# Altium project Dozimetr v1.0.PrjPcb
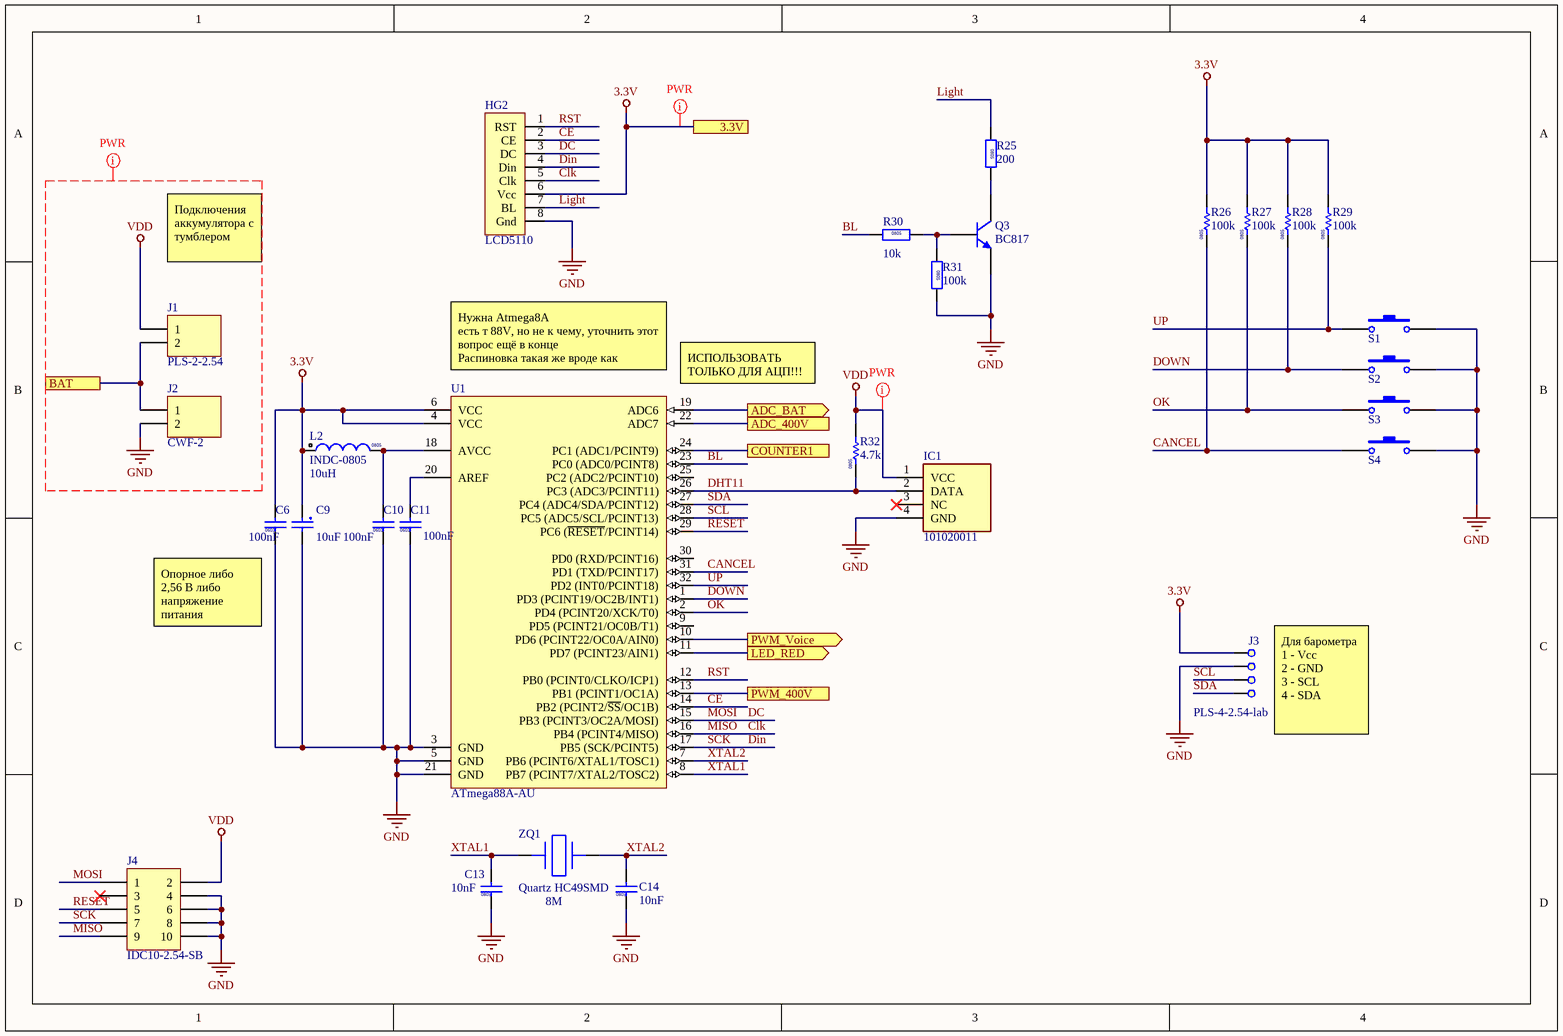
[diagram p0: MCU.SchDoc]
3 sheets, 69 parts. Net scope: flat (ports and power ports of the same name join across sheets).
Board file: PCB_Dozimeter.PcbDoc
Sheets:
  MCU.SchDoc
  High_Voltage.SchDoc
  Indication_and_Notification.SchDoc

## Sheet MCU.SchDoc
size A4

### Parts
C6  value 100nF  [CAPC1608-0603L]  (hidden comment: CAPC_0603)
C9  value 10uF  [TCAPC_A]  (hidden comment: TCAPC_A)
C10  value 100nF  [CAPC1608-0603L]  (hidden comment: CAPC_0603)
C11  value 100nF  [CAPC1608-0603L]  (hidden comment: CAPC_0603)
C13  value 10nF  [CAPC2012-0805M]  (hidden comment: CAPC_0805)
C14  value 10nF  [CAPC2012-0805M]  (hidden comment: CAPC_0805)
HG2  LCD5110  [LCD]
IC1  101020011  [HDRV4W80P0X254_1X4_1200X500X1550P]
J1  PLS-2-2.54  [PLS-2-2.54]
J2  CWF-2  [CWF-2]
J3  PLS-4-2.54-lab  [PLS-4-2.54-lab]
J4  IDC10-2.54-SB  [IDC10-2.54-SB]
L2  INDC-0805  value 10uH  [INDC2012L]
Q3  BC817  [SOT23-3M]
R25  value 200  [RESC2012-0805M]  (hidden comment: RESC_0805_R)
R26  value 100k  [RESC2012-0805M]  (hidden comment: RESC_0805)
R27  value 100k  [RESC2012-0805M]  (hidden comment: RESC_0805)
R28  value 100k  [RESC2012-0805M]  (hidden comment: RESC_0805)
R29  value 100k  [RESC2012-0805M]  (hidden comment: RESC_0805)
R30  value 10k  [RESC2012-0805M]  (hidden comment: RESC_0805_R)
R31  value 100k  [RESC2012-0805M]  (hidden comment: RESC_0805_R)
R32  value 4.7k  [RESC2012-0805M]  (hidden comment: RESC_0805)
S1  Switch  [Switch]  (value not drawn)
S2  Switch  [Switch]  (value not drawn)
S3  Switch  [Switch]  (value not drawn)
S4  Switch  [Switch]  (value not drawn)
U1  ATmega88A-AU  [32A_L]
ZQ1  Quartz HC49SMD  value 8M  [HC-49SMD]

### Ports
3.3V, ADC_400V, ADC_BAT (out), BAT, COUNTER1, LED_RED (out), PWM_400V, PWM_Voice (out)

### Nets
3.3V: C6.2 C9.1 HG2.6(Vcc) J3.1 L2.1 R26.2 R27.2 R28.2 R29.2 U1.4(VCC) U1.6(VCC) ; port 3.3V
GND: C6.1 C9.2 C10.1 C11.1 C13.1 C14.1 HG2.8(Gnd) IC1.4(GND) J2.2 J3.2 J4.4 J4.6 J4.8 J4.10 Q3.2(E) R31.2 S1.2 S2.2 S3.2 S4.2 U1.3(GND) U1.5(GND) U1.21(GND)
VDD: IC1.1(VCC) J1.1 J4.2 R32.2
BL: R30.1 U1.23(PC0_(ADC0/PCINT8))
CANCEL: R26.1 S4.1 U1.31(PD1_(TXD/PCINT17))
CE: HG2.2(CE) U1.14(PB2_(PCINT2/~{SS}/OC1B))
Clk: HG2.5(Clk) J4.9 U1.16(PB4_(PCINT4/MISO))  [also labelled MISO]
DC: HG2.3(DC) J4.1 U1.15(PB3_(PCINT3/OC2A/MOSI))  [also labelled MOSI]
DHT11: IC1.2(DATA) R32.1 U1.26(PC3_(ADC3/PCINT11))
Din: HG2.4(Din) J4.7 U1.17(PB5_(SCK/PCINT5))  [also labelled SCK]
DOWN: R28.1 S2.1 U1.1(PD3_(PCINT19/OC2B/INT1))
Light: HG2.7(BL) R25.1
OK: R27.1 S3.1 U1.2(PD4_(PCINT20/XCK/T0))
RESET: J4.5 U1.29(PC6_(~{RESET}/PCINT14))
RST: HG2.1(RST) U1.12(PB0_(PCINT0/CLKO/ICP1))
SCL: J3.3 U1.28(PC5_(ADC5/SCL/PCINT13))
SDA: J3.4 U1.27(PC4_(ADC4/SDA/PCINT12))
UP: R29.1 S1.1 U1.32(PD2_(INT0/PCINT18))
XTAL1: C13.2 U1.8(PB7_(PCINT7/XTAL2/TOSC2)) ZQ1.1
XTAL2: C14.2 U1.7(PB6_(PCINT6/XTAL1/TOSC1)) ZQ1.2
NetC3_2: U1.22(ADC7) ; port ADC_400V
NetC10_2: C10.2 L2.2 U1.18(AVCC)
NetC11_2: C11.2 U1.20(AREF)
NetJ1_2: J1.2 J2.1 ; port BAT
NetQ3_1: Q3.1(B) R30.2 R31.1
NetQ3_3: Q3.3(C) R25.2
NetR13_1: U1.13(PB1_(PCINT1/OC1A)) ; port PWM_400V
NetR17_1: U1.24(PC1_(ADC1/PCINT9)) ; port COUNTER1
NetR21_1: U1.11(PD7_(PCINT23/AIN1)) ; port LED_RED
NetR22_1: U1.10(PD6_(PCINT22/OC0A/AIN0)) ; port PWM_Voice
NetU1_19: U1.19(ADC6) ; port ADC_BAT

Not connected (* = marked no-connect by the designer): IC1 3(NC)*; J4 3*; U1 9(PD5_(PCINT21/OC0B/T1)) 25(PC2_(ADC2/PCINT10)) 30(PD0_(RXD/PCINT16))

### Layout directives
mark named PWR: 3.3V, GND, VDD

### Notes on the sheet
- Подключения аккумулятора с тумблером
- (near U1) Нужна Atmega8A
  есть т 88V, но не к чему, уточнить этот вопрос ещё в конце
  Распиновка такая же вроде как
- (near U1) ИСПОЛЬЗОВАТЬ ТОЛЬКО ДЛЯ АЦП!!!
- Опорное либо 2,56 В либо напряжение питания
- (near J3) Для барометра
  1 - Vcc
  2 - GND
  3 - SCL
  4 - SDA
- (in symbol CAPC_0603) 0603
- (in symbol CAPC_0805) 0805
- (in symbol INDC-0805) 0805
- (in symbol RESC_0805) 0805
- (in symbol RESC_0805_R) 0805

### Library data of the parts
C6 C10 C11 = CAPC_0603: Capacitor 0603
C9 = TCAPC_A: Capacitor tantalum SMD type A
C13 C14 = CAPC_0805: Capacitor 0805
HG2 = LCD5110: Дисплей Nokia 5110 84x48
IC1 = 101020011: Integrated Circuit; Manufacturer_Name: Seeed Studio; Datasheet Link: https://componentsearchengine.com/Datasheets/1/101020011.pdf; Height: 15.5mm; Manufacturer_Part_Number: 101020011; Mouser Part Number: 713-101020011; Mouser Price/Stock: https://www.mouser.com/Search/Refine.aspx?Keyword=713-101020011; RS Part Number: 1743237; RS Price/Stock: http://uk.rs-online.com/web/p/products/1743237
J4 = IDC10-2.54-SB: IDC10 2.54 mm pitch Straight, plastic Box; LatestRevisionDate: 17-Jul-2002; LatestRevisionNote: Re-released for DXP Platform.; Publisher: Altium Limited
L2 = INDC-0805: Chip Inductor, Body Body 2.0x1.2mm
Q3 = BC817: BC817 NPN Transistor
R25 R30 R31 = RESC_0805_R: Resistor 0805
R26-R29 R32 = RESC_0805: Resistor 0805
U1 = ATmega88A-AU: 8-bit AVR Microcontroller, 8KB Flash, 512 Bytes EEPROM, 1KB SRAM, 32-pin TQFP, Industrial Grade (-40°C to 85°C); Published: 1-Apr-2010; DatasheetVersion: revA, Jan-2010; PackageVersion: revB, Oct-2001; PackageReference: 32A; Publisher: Altium Limited; PackageDescription: 32-Lead, 7x7x1.0 mm Body, 0.8mm Lead Pitch, Thin Profile Plastic Quad Flat Package (TQFP); Supplier 1: Digi-Key; Supplier Part Number 1: ATMEGA88A-AU-ND; Supplier 2: Mouser; Supplier Part Number 2: 556-ATMEGA88A-AU; Code_JEDEC: MS-026-ABA; ComponentLink1Description: Manufacturer Link; ComponentLink1URL: http://www.atmel.com/products/avr/default.asp?; ComponentLink2Description: ATmega48A/48PA/88A/88PA/168A/168PA/328/328P Datasheet; ComponentLink2URL: http://www.atmel.com/dyn/resources/prod_documents/8271.pdf; ComponentLink3Description: ATmega48A/48PA/88A/88PA/168A/168PA/328/328P Summary; ComponentLink3URL: http://www.atmel.com/dyn/resources/prod_documents/8271S.pdf; ComponentLink4Description: Atmel.com Home; ComponentLink4URL: http://www.atmel.com
J1 = PLS-2-2.54: LatestRevisionDate: 17-Jul-2002; LatestRevisionNote: Re-released for DXP Platform.; Publisher: Altium Limited
J3 = PLS-4-2.54-lab: LatestRevisionDate: 17-Jul-2002; LatestRevisionNote: Re-released for DXP Platform.; Publisher: Altium Limited
S1-S4 = Switch: Published: 24-Mar-1999; LatestRevisionDate: 17-Jul-2002; LatestRevisionNote: Re-released for DXP Platform.; PackageReference: SPST-2; Publisher: Altium Limited

## Sheet High_Voltage.SchDoc
size A4
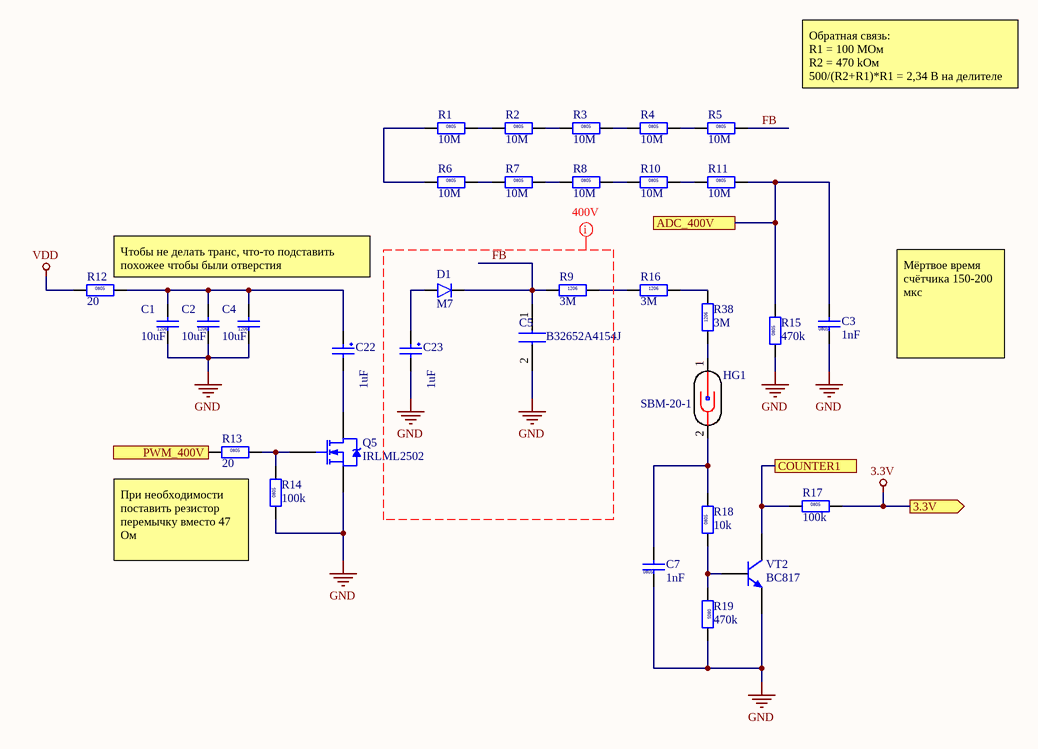
[diagram p1: High_Voltage.SchDoc]

### Parts
C1  value 10uF  [CAPC3216-1206L]  (hidden comment: CAPC_1206)
C2  value 10uF  [CAPC3216-1206L]  (hidden comment: CAPC_1206)
C3  value 1nF  [CAPC2012-0805M]  (hidden comment: CAPC_0805)
C4  value 10uF  [CAPC3216-1206L]  (hidden comment: CAPC_1206)
C5  B32652A4154J  [B32652A4154J]
C7  value 1nF  [CAPC2012-0805M]  (hidden comment: CAPC_0805)
C22  value 1uF  [ECAP811.5]  (hidden comment: ECAP-811.5)
C23  value 1uF  [ECAP16315]  (hidden comment: ECAP-1625)
D1  M7  [DIOM5026X262N]
HG1  SBM-20-1  [SBM-20-1]
Q5  IRLML2502  [SOT23-3L]
R1  value 10M  [RESC2012-0805M]  (hidden comment: RESC_0805_R)
R2  value 10M  [RESC2012-0805M]  (hidden comment: RESC_0805_R)
R3  value 10M  [RESC2012-0805M]  (hidden comment: RESC_0805_R)
R4  value 10M  [RESC2012-0805M]  (hidden comment: RESC_0805_R)
R5  value 10M  [RESC2012-0805M]  (hidden comment: RESC_0805_R)
R6  value 10M  [RESC2012-0805M]  (hidden comment: RESC_0805_R)
R7  value 10M  [RESC2012-0805M]  (hidden comment: RESC_0805_R)
R8  value 10M  [RESC2012-0805M]  (hidden comment: RESC_0805_R)
R9  value 3M  [RESC3216-1206M]  (hidden comment: RESC_1206_R)
R10  value 10M  [RESC2012-0805M]  (hidden comment: RESC_0805_R)
R11  value 10M  [RESC2012-0805M]  (hidden comment: RESC_0805_R)
R12  value 20  [RESC2012-0805M]  (hidden comment: RESC_0805_R)
R13  value 20  [RESC2012-0805M]  (hidden comment: RESC_0805_R)
R14  value 100k  [RESC2012-0805M]  (hidden comment: RESC_0805_R)
R15  value 470k  [RESC2012-0805M]  (hidden comment: RESC_0805_R)
R16  value 3M  [RESC3216-1206M]  (hidden comment: RESC_1206_R)
R17  value 100k  [RESC2012-0805M]  (hidden comment: RESC_0805_R)
R18  value 10k  [RESC2012-0805M]  (hidden comment: RESC_0805_R)
R19  value 470k  [RESC2012-0805M]  (hidden comment: RESC_0805_R)
R38  value 3M  [RESC3216-1206M]  (hidden comment: RESC_1206_R)
VT2  BC817  [SOT23-3M]

### Ports
3.3V (out), ADC_400V, COUNTER1, PWM_400V

### Nets
3.3V: R17.2 ; port 3.3V
GND: C1.1 C2.1 C3.1 C4.1 C5.2 C7.1 C23.2 Q5.2(S) R14.1 R15.1 R19.2 VT2.2(E)
VDD: R12.1
FB: C5.1 D1.1(K) R5.2 R9.1
NetC1_2: C1.2 C2.2 C4.2 C22.1 R12.2
NetC3_2: C3.2 R11.2 R15.2 ; port ADC_400V
NetC7_2: C7.2 HG1.2(K) R18.2
NetC22_2: C22.2 Q5.3(D)
NetC23_1: C23.1 D1.2(A)
NetHG1_1: HG1.1(A) R38.1
NetQ5_1: Q5.1(G) R13.2 R14.2
NetR1_1: R1.1 R6.1
NetR1_2: R1.2 R2.1
NetR2_2: R2.2 R3.1
NetR3_2: R3.2 R4.1
NetR4_2: R4.2 R5.1
NetR6_2: R6.2 R7.1
NetR7_2: R7.2 R8.1
NetR8_2: R8.2 R10.1
NetR9_2: R9.2 R16.1
NetR10_2: R10.2 R11.1
NetR13_1: R13.1 ; port PWM_400V
NetR16_2: R16.2 R38.2
NetR17_1: R17.1 VT2.3(C) ; port COUNTER1
NetR18_1: R18.1 R19.1 VT2.1(B)

### Layout directives
net class 400V: FB, GND

### Notes on the sheet
- Обратная связь:
  R1 = 100 МОм
  R2 = 470 kОм
  500/(R2+R1)*R1 = 2,34 В на делителе
- (near R12) Чтобы не делать транс, что-то подставить похожее чтобы были отверстия
- Мёртвое время счётчика 150-200 мкс
- При необходимости поставить резистор перемычку вместо 47 Ом
- (in symbol CAPC_0805) 0805
- (in symbol CAPC_1206) 1206
- (in symbol RESC_0805_R) 0805
- (in symbol RESC_1206_R) 1206

### Library data of the parts
C1 C2 C4 = CAPC_1206: Capacitor 1206
C3 C7 = CAPC_0805: Capacitor 0805
C5 = B32652A4154J: Capacitor; Manufacturer_Name: EPCOS; Datasheet Link: https://componentsearchengine.com/Datasheets/1/B32652A4154J.pdf; Height: 18mm; Manufacturer_Part_Number: B32652A4154J; Mouser Part Number: 871-B32652A4154J; Mouser Price/Stock: https://www.mouser.com/Search/Refine.aspx?Keyword=871-B32652A4154J
C22 = ECAP-811.5: Capacitor electrolytic 3.5 mm pitch, 8*11.5 body
C23 = ECAP-1625: Capacitor electrolytic 7.5 mm pitch, 16*25 body
D1 = M7: Diode; Manufacturer_Name: MULTICOMP; Manufacturer_Part_Number: SS34A; Datasheet Link: https://componentsearchengine.com/Datasheets/2/SS34A.pdf; Height: 2.62mm
Q5 = IRLML2502: IRLML2502 Hexfet power MOSFET
R1-R8 R10-R15 R17-R19 = RESC_0805_R: Resistor 0805
R9 R16 R38 = RESC_1206_R: Resistor 1206
VT2 = BC817: BC817 NPN Transistor

## Sheet Indication_and_Notification.SchDoc
size A4
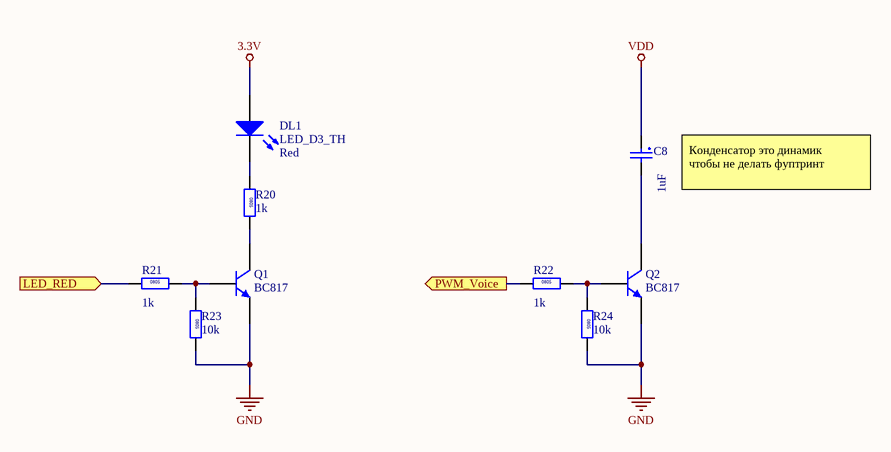
[diagram p2: Indication_and_Notification.SchDoc]

### Parts
C8  value 1uF  [ECAP1325]  (hidden comment: ECAP-1325)
DL1  LED_D3_TH  value Red  [LED_D3_TH]
Q1  BC817  [SOT23-3M]
Q2  BC817  [SOT23-3M]
R20  value 1k  [RESC2012-0805M]  (hidden comment: RESC_0805_R)
R21  value 1k  [RESC2012-0805M]  (hidden comment: RESC_0805_R)
R22  value 1k  [RESC2012-0805M]  (hidden comment: RESC_0805_R)
R23  value 10k  [RESC2012-0805M]  (hidden comment: RESC_0805_R)
R24  value 10k  [RESC2012-0805M]  (hidden comment: RESC_0805_R)

### Ports
LED_RED (in), PWM_Voice (out)

### Nets
3.3V: DL1.1(A)
GND: Q1.2(E) Q2.2(E) R23.2 R24.2
VDD: C8.1
NetC8_2: C8.2 Q2.3(C)
NetDL1_2: DL1.2(K) R20.1
NetQ1_1: Q1.1(B) R21.2 R23.1
NetQ1_3: Q1.3(C) R20.2
NetQ2_1: Q2.1(B) R22.2 R24.1
NetR21_1: R21.1 ; port LED_RED
NetR22_1: R22.1 ; port PWM_Voice

### Notes on the sheet
- (near C8) Конденсатор это динамик
  чтобы не делать фуптринт
- (in symbol RESC_0805_R) 0805

### Library data of the parts
C8 = ECAP-1325: Capacitor electrolytic 5 mm pitch, 13*25 body
DL1 = LED_D3_TH: LED Through hole D3mm
Q1 Q2 = BC817: BC817 NPN Transistor
R20-R24 = RESC_0805_R: Resistor 0805

## Nets that join several sheets
3.3V: MCU (11 pins), High_Voltage (R17.2), Indication_and_Notification (DL1.1)
GND: MCU (23 pins), High_Voltage (12 pins), Indication_and_Notification (Q1.2 Q2.2 R23.2 R24.2)
VDD: MCU (IC1.1 J1.1 J4.2 R32.2), High_Voltage (R12.1), Indication_and_Notification (C8.1)
NetC3_2: MCU (U1.22), High_Voltage (C3.2 R11.2 R15.2)
NetR13_1: MCU (U1.13), High_Voltage (R13.1)
NetR17_1: MCU (U1.24), High_Voltage (R17.1 VT2.3)
NetR21_1: MCU (U1.11), Indication_and_Notification (R21.1)
NetR22_1: MCU (U1.10), Indication_and_Notification (R22.1)